# EAGLE design LEDMatrix (EAGLE 8.5.1)
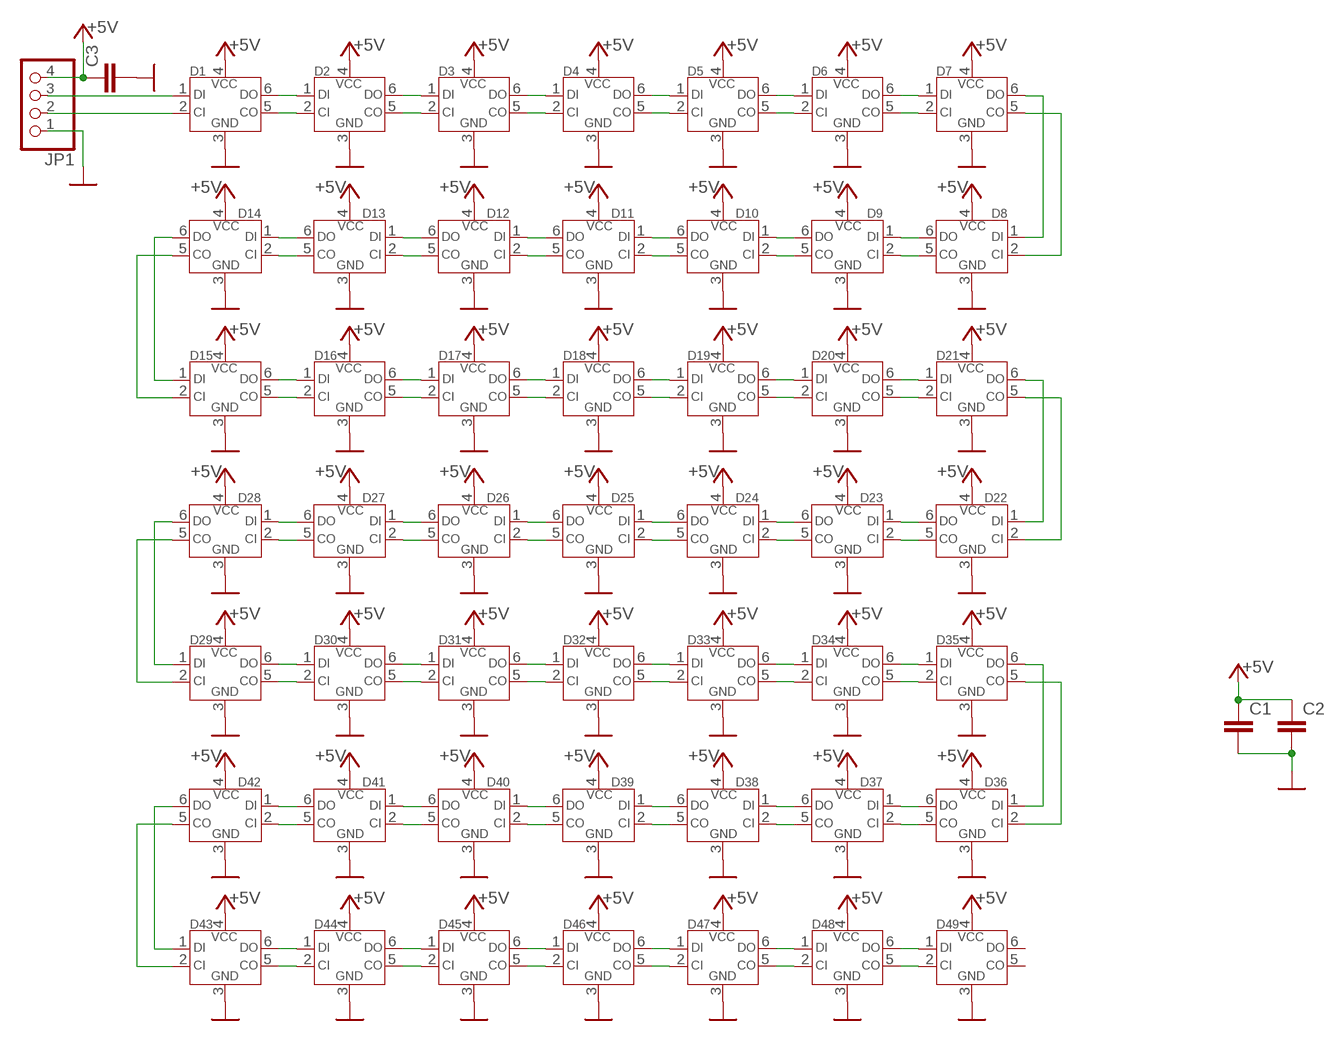
[diagram p0: schematic, sheet 1]

## Parts
C1  C-EUC0805  [C0805]
C2  C-EUC0805  [C0805]
C3  C-EUC0805  [C0805]
D1  QBLP679E-RGB  [LED_QBLP679E-RGB]
D2  QBLP679E-RGB  [LED_QBLP679E-RGB]
D3  QBLP679E-RGB  [LED_QBLP679E-RGB]
D4  QBLP679E-RGB  [LED_QBLP679E-RGB]
D5  QBLP679E-RGB  [LED_QBLP679E-RGB]
D6  QBLP679E-RGB  [LED_QBLP679E-RGB]
D7  QBLP679E-RGB  [LED_QBLP679E-RGB]
D8  QBLP679E-RGB  [LED_QBLP679E-RGB]
D9  QBLP679E-RGB  [LED_QBLP679E-RGB]
D10  QBLP679E-RGB  [LED_QBLP679E-RGB]
D11  QBLP679E-RGB  [LED_QBLP679E-RGB]
D12  QBLP679E-RGB  [LED_QBLP679E-RGB]
D13  QBLP679E-RGB  [LED_QBLP679E-RGB]
D14  QBLP679E-RGB  [LED_QBLP679E-RGB]
D15  QBLP679E-RGB  [LED_QBLP679E-RGB]
D16  QBLP679E-RGB  [LED_QBLP679E-RGB]
D17  QBLP679E-RGB  [LED_QBLP679E-RGB]
D18  QBLP679E-RGB  [LED_QBLP679E-RGB]
D19  QBLP679E-RGB  [LED_QBLP679E-RGB]
D20  QBLP679E-RGB  [LED_QBLP679E-RGB]
D21  QBLP679E-RGB  [LED_QBLP679E-RGB]
D22  QBLP679E-RGB  [LED_QBLP679E-RGB]
D23  QBLP679E-RGB  [LED_QBLP679E-RGB]
D24  QBLP679E-RGB  [LED_QBLP679E-RGB]
D25  QBLP679E-RGB  [LED_QBLP679E-RGB]
D26  QBLP679E-RGB  [LED_QBLP679E-RGB]
D27  QBLP679E-RGB  [LED_QBLP679E-RGB]
D28  QBLP679E-RGB  [LED_QBLP679E-RGB]
D29  QBLP679E-RGB  [LED_QBLP679E-RGB]
D30  QBLP679E-RGB  [LED_QBLP679E-RGB]
D31  QBLP679E-RGB  [LED_QBLP679E-RGB]
D32  QBLP679E-RGB  [LED_QBLP679E-RGB]
D33  QBLP679E-RGB  [LED_QBLP679E-RGB]
D34  QBLP679E-RGB  [LED_QBLP679E-RGB]
D35  QBLP679E-RGB  [LED_QBLP679E-RGB]
D36  QBLP679E-RGB  [LED_QBLP679E-RGB]
D37  QBLP679E-RGB  [LED_QBLP679E-RGB]
D38  QBLP679E-RGB  [LED_QBLP679E-RGB]
D39  QBLP679E-RGB  [LED_QBLP679E-RGB]
D40  QBLP679E-RGB  [LED_QBLP679E-RGB]
D41  QBLP679E-RGB  [LED_QBLP679E-RGB]
D42  QBLP679E-RGB  [LED_QBLP679E-RGB]
D43  QBLP679E-RGB  [LED_QBLP679E-RGB]
D44  QBLP679E-RGB  [LED_QBLP679E-RGB]
D45  QBLP679E-RGB  [LED_QBLP679E-RGB]
D46  QBLP679E-RGB  [LED_QBLP679E-RGB]
D47  QBLP679E-RGB  [LED_QBLP679E-RGB]
D48  QBLP679E-RGB  [LED_QBLP679E-RGB]
D49  QBLP679E-RGB  [LED_QBLP679E-RGB]
JP1  PINHD-1X4  [1X04]

## Nets
+5V: C1.1 C2.1 C3.1 D1.4(VCC) D2.4(VCC) D3.4(VCC) D4.4(VCC) D5.4(VCC) D6.4(VCC) D7.4(VCC) D8.4(VCC) D9.4(VCC) D10.4(VCC) D11.4(VCC) D12.4(VCC) D13.4(VCC) D14.4(VCC) D15.4(VCC) D16.4(VCC) D17.4(VCC) D18.4(VCC) D19.4(VCC) D20.4(VCC) D21.4(VCC) D22.4(VCC) D23.4(VCC) D24.4(VCC) D25.4(VCC) D26.4(VCC) D27.4(VCC) D28.4(VCC) D29.4(VCC) D30.4(VCC) D31.4(VCC) D32.4(VCC) D33.4(VCC) D34.4(VCC) D35.4(VCC) D36.4(VCC) D37.4(VCC) D38.4(VCC) D39.4(VCC) D40.4(VCC) D41.4(VCC) D42.4(VCC) D43.4(VCC) D44.4(VCC) D45.4(VCC) D46.4(VCC) D47.4(VCC) D48.4(VCC) D49.4(VCC) JP1.4
GND: C1.2 C2.2 C3.2 D1.3(GND) D2.3(GND) D3.3(GND) D4.3(GND) D5.3(GND) D6.3(GND) D7.3(GND) D8.3(GND) D9.3(GND) D10.3(GND) D11.3(GND) D12.3(GND) D13.3(GND) D14.3(GND) D15.3(GND) D16.3(GND) D17.3(GND) D18.3(GND) D19.3(GND) D20.3(GND) D21.3(GND) D22.3(GND) D23.3(GND) D24.3(GND) D25.3(GND) D26.3(GND) D27.3(GND) D28.3(GND) D29.3(GND) D30.3(GND) D31.3(GND) D32.3(GND) D33.3(GND) D34.3(GND) D35.3(GND) D36.3(GND) D37.3(GND) D38.3(GND) D39.3(GND) D40.3(GND) D41.3(GND) D42.3(GND) D43.3(GND) D44.3(GND) D45.3(GND) D46.3(GND) D47.3(GND) D48.3(GND) D49.3(GND) JP1.1
N$1: D1.6(DO) D2.1(DI)
N$2: D1.5(CO) D2.2(CI)
N$3: D2.6(DO) D3.1(DI)
N$4: D2.5(CO) D3.2(CI)
N$5: D3.6(DO) D4.1(DI)
N$6: D3.5(CO) D4.2(CI)
N$7: D4.6(DO) D5.1(DI)
N$8: D4.5(CO) D5.2(CI)
N$9: D5.6(DO) D6.1(DI)
N$10: D5.5(CO) D6.2(CI)
N$11: D6.6(DO) D7.1(DI)
N$12: D6.5(CO) D7.2(CI)
N$13: D8.6(DO) D9.1(DI)
N$14: D8.5(CO) D9.2(CI)
N$15: D9.6(DO) D10.1(DI)
N$16: D9.5(CO) D10.2(CI)
N$17: D10.6(DO) D11.1(DI)
N$18: D10.5(CO) D11.2(CI)
N$19: D11.6(DO) D12.1(DI)
N$20: D11.5(CO) D12.2(CI)
N$21: D12.6(DO) D13.1(DI)
N$22: D12.5(CO) D13.2(CI)
N$23: D13.6(DO) D14.1(DI)
N$24: D13.5(CO) D14.2(CI)
N$25: D7.6(DO) D8.1(DI)
N$26: D7.5(CO) D8.2(CI)
N$27: D15.6(DO) D16.1(DI)
N$28: D15.5(CO) D16.2(CI)
N$29: D16.6(DO) D17.1(DI)
N$30: D16.5(CO) D17.2(CI)
N$31: D17.6(DO) D18.1(DI)
N$32: D17.5(CO) D18.2(CI)
N$33: D18.6(DO) D19.1(DI)
N$34: D18.5(CO) D19.2(CI)
N$35: D19.6(DO) D20.1(DI)
N$36: D19.5(CO) D20.2(CI)
N$37: D20.6(DO) D21.1(DI)
N$38: D20.5(CO) D21.2(CI)
N$39: D22.6(DO) D23.1(DI)
N$40: D22.5(CO) D23.2(CI)
N$41: D23.6(DO) D24.1(DI)
N$42: D23.5(CO) D24.2(CI)
N$43: D24.6(DO) D25.1(DI)
N$44: D24.5(CO) D25.2(CI)
N$45: D25.6(DO) D26.1(DI)
N$46: D25.5(CO) D26.2(CI)
N$47: D26.6(DO) D27.1(DI)
N$48: D26.5(CO) D27.2(CI)
N$49: D27.6(DO) D28.1(DI)
N$50: D27.5(CO) D28.2(CI)
N$51: D21.6(DO) D22.1(DI)
N$52: D21.5(CO) D22.2(CI)
N$53: D29.6(DO) D30.1(DI)
N$54: D29.5(CO) D30.2(CI)
N$55: D30.6(DO) D31.1(DI)
N$56: D30.5(CO) D31.2(CI)
N$57: D31.6(DO) D32.1(DI)
N$58: D31.5(CO) D32.2(CI)
N$59: D32.6(DO) D33.1(DI)
N$60: D32.5(CO) D33.2(CI)
N$61: D33.6(DO) D34.1(DI)
N$62: D33.5(CO) D34.2(CI)
N$63: D34.6(DO) D35.1(DI)
N$64: D34.5(CO) D35.2(CI)
N$65: D36.6(DO) D37.1(DI)
N$66: D36.5(CO) D37.2(CI)
N$67: D37.6(DO) D38.1(DI)
N$68: D37.5(CO) D38.2(CI)
N$69: D38.6(DO) D39.1(DI)
N$70: D38.5(CO) D39.2(CI)
N$71: D39.6(DO) D40.1(DI)
N$72: D39.5(CO) D40.2(CI)
N$73: D40.6(DO) D41.1(DI)
N$74: D40.5(CO) D41.2(CI)
N$75: D41.6(DO) D42.1(DI)
N$76: D41.5(CO) D42.2(CI)
N$77: D35.6(DO) D36.1(DI)
N$78: D35.5(CO) D36.2(CI)
N$79: D14.6(DO) D15.1(DI)
N$80: D14.5(CO) D15.2(CI)
N$81: D28.6(DO) D29.1(DI)
N$82: D28.5(CO) D29.2(CI)
N$83: D43.6(DO) D44.1(DI)
N$84: D43.5(CO) D44.2(CI)
N$85: D44.6(DO) D45.1(DI)
N$86: D44.5(CO) D45.2(CI)
N$87: D45.6(DO) D46.1(DI)
N$88: D45.5(CO) D46.2(CI)
N$89: D46.6(DO) D47.1(DI)
N$90: D46.5(CO) D47.2(CI)
N$91: D47.6(DO) D48.1(DI)
N$92: D47.5(CO) D48.2(CI)
N$93: D48.6(DO) D49.1(DI)
N$94: D48.5(CO) D49.2(CI)
N$95: D1.1(DI) JP1.3
N$96: D1.2(CI) JP1.2
N$97: D42.6(DO) D43.1(DI)
N$98: D42.5(CO) D43.2(CI)
Unconnected: D49.5(CO) D49.6(DO)

## Library data of the parts
C1-C3 = rcl:C-EU: CAPACITOR, European symbol; SPICEPREFIX: C
D1-D49 = APA102-5050:QBLP679E-RGB: LED RGB DIFFUSED 6SMD; AVAILABILITY: Unavailable; DESCRIPTION: Led Rgb Diffused 6smd; MF: QT Brightek; MP: QBLP679E-RGB; PACKAGE: PLCC-6 QT Brightek; PRICE: None
JP1 = pinhead:PINHD-1X4: PIN HEADER

## Board
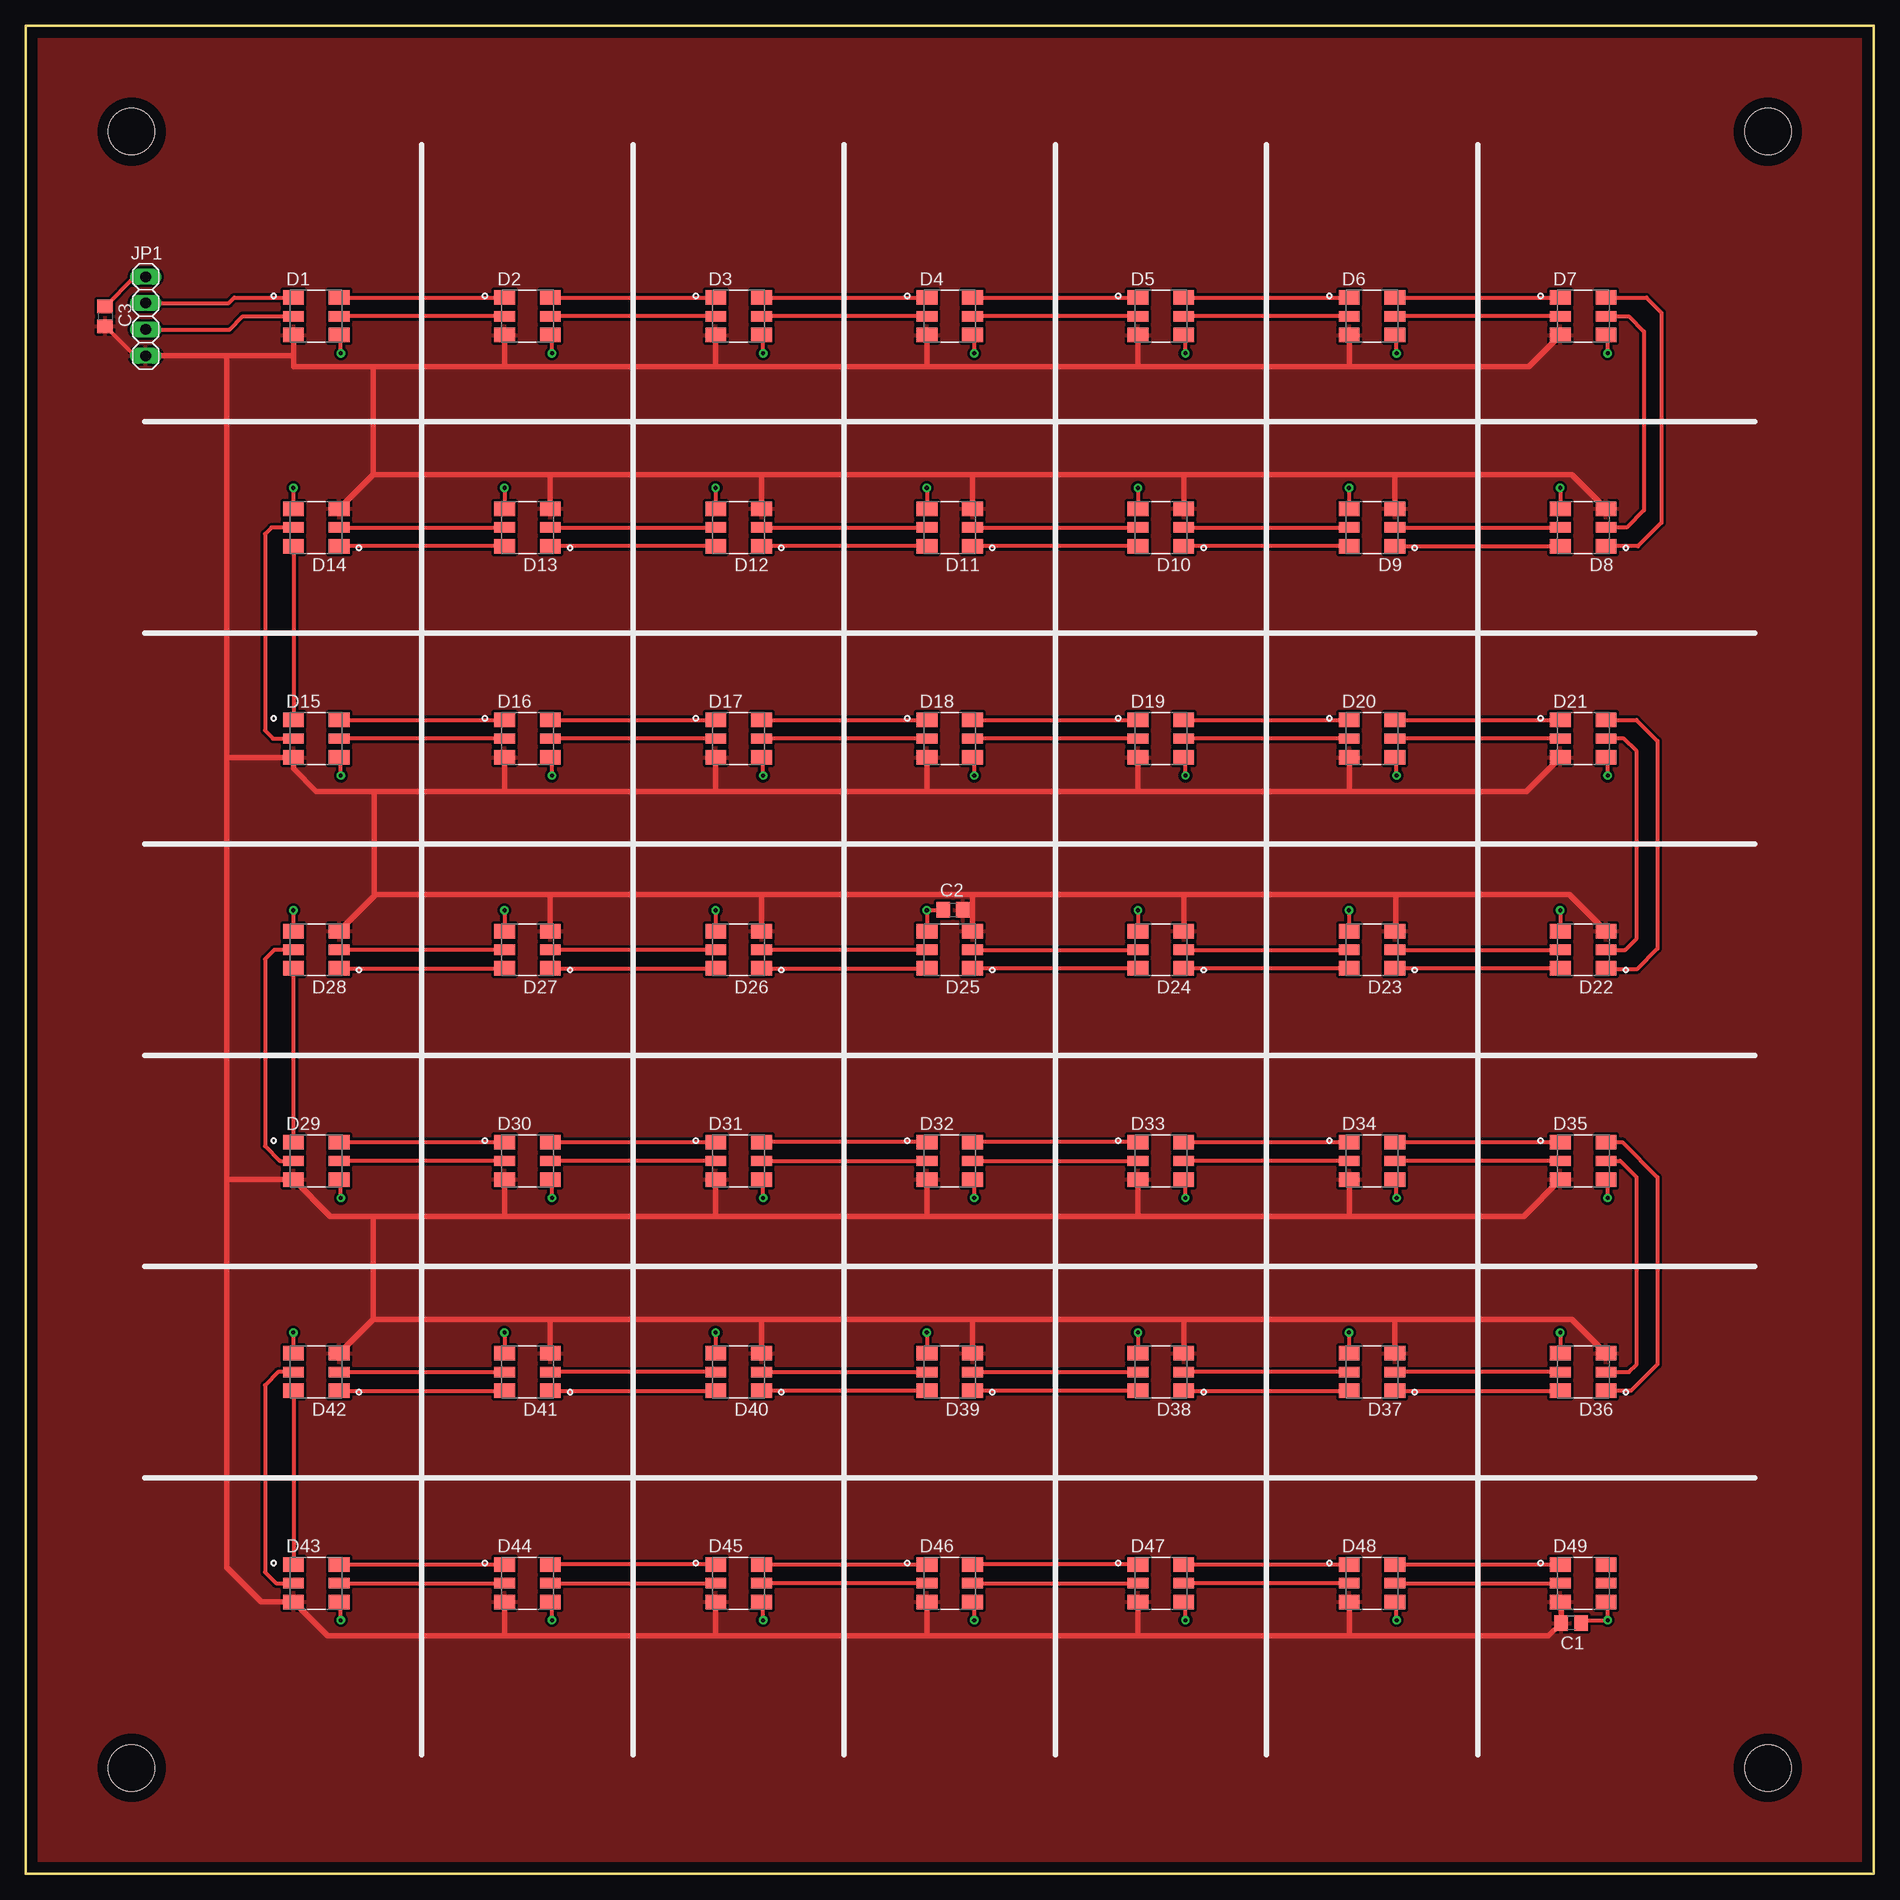
[diagram p1: board, top side]
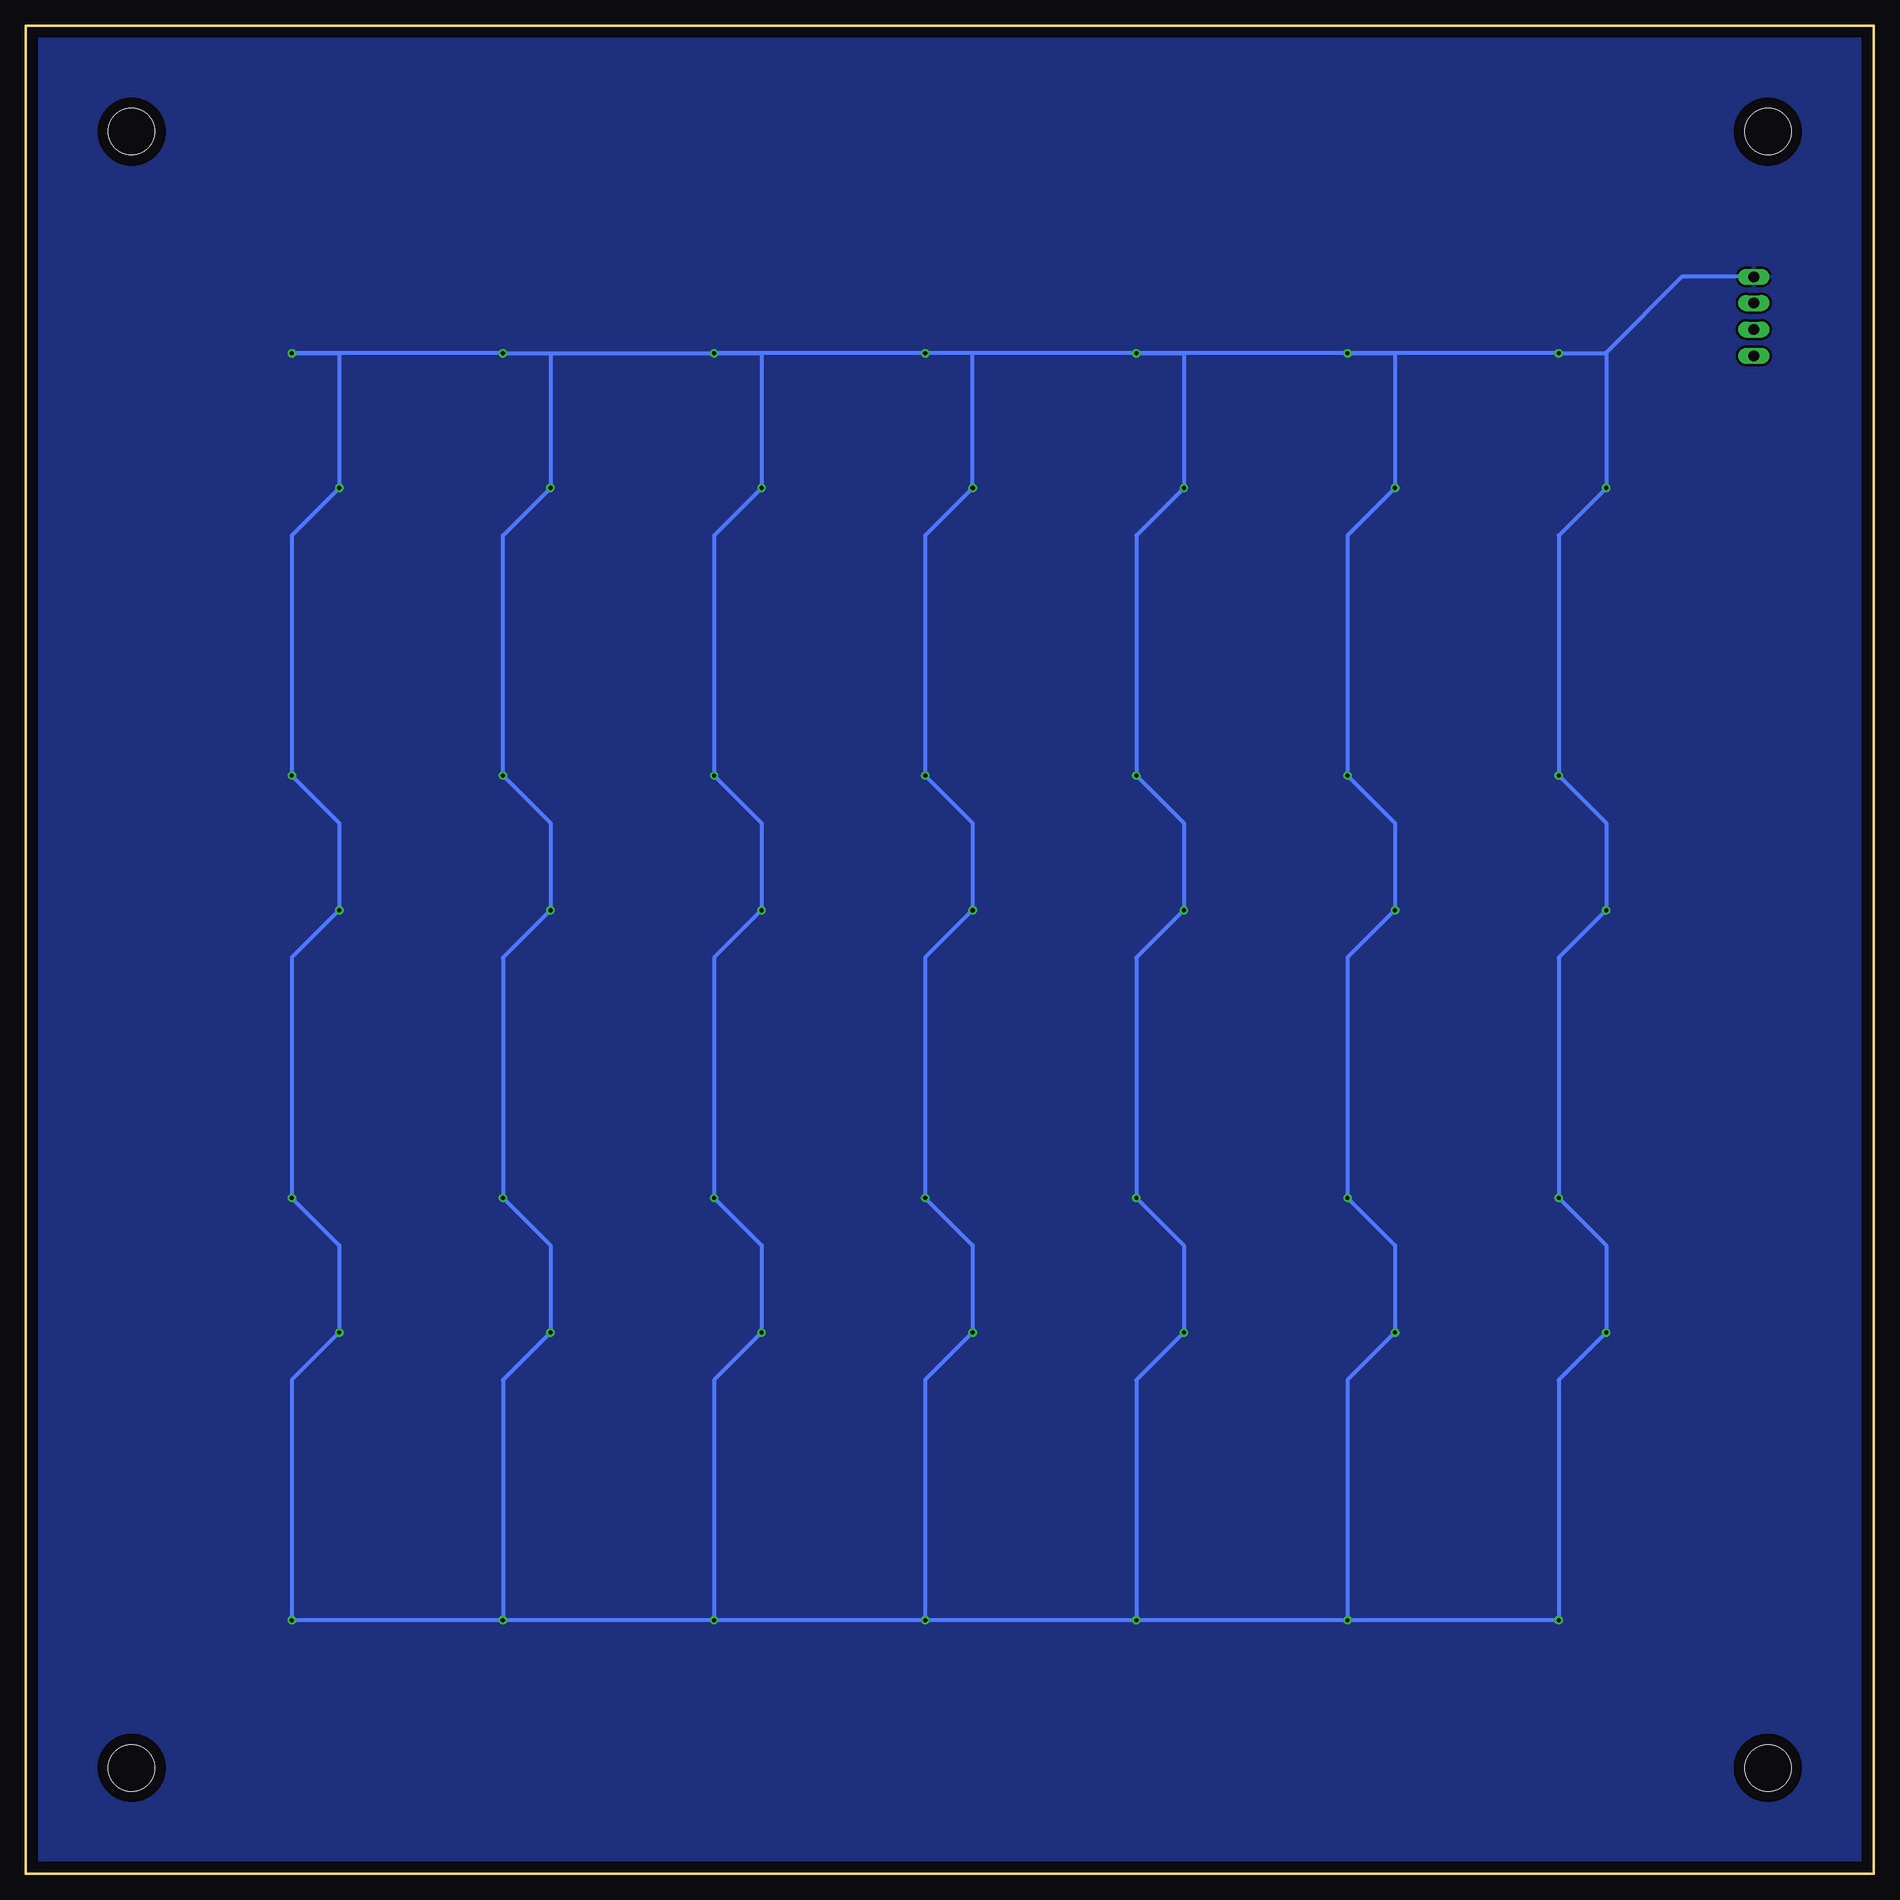
[diagram p2: board, bottom side, seen from below]

Size 177.8 x 177.8 mm. Coordinates in mm from the lower left corner, seen from the top.
Outline: 0,0 0,177.8 177.8,177.8 177.8,0 0,0
Copper layers (1*16): Top 0.035mm / dielectric 1.5mm / Bottom 0.035mm
Design rules "default": minimum track width 6mil, minimum drill 0.35mm, track to track 6mil, track to pad 6mil, pad to pad 6mil, via to via 6mil, smd to smd 6mil, copper to edge 40mil, drill to drill 6mil, minimum pad ring 10mil, minimum via ring 8mil, stop-mask expansion 4mil, vias tented up to drill 0mil, thermal gap 10mil
Holes 4.5 mm at 10.16,167.64 167.64,167.64 10.16,10.16 167.64,10.16

### Footprints (pad centres in the part's own frame; a part is rotated, then mirrored left to right if it is on the bottom)
C0805 = smd 1.3 x 1.5: 1 -0.95,0; 2 0.95,0
LED_QBLP679E-RGB = smd 2 x 1.4: 1 -2.2,1.8; 3 -2.2,-1.8; 4 2.2,-1.8; 6 2.2,1.8 | smd 2 x 1: 2 -2.2,0; 5 2.2,0
1X04 = drill 1.016 long: 1 -3.81,0; 2 -1.27,0; 3 1.27,0; 4 3.81,0

### Placement (x,y rotation side)
C1  148.7,24.1 180 top
C2  89.21,92.74 0 top
C3  7.62,149.86 270 top
D1  27.94,149.86 0 top
D2  48.26,149.86 0 top
D3  68.58,149.86 0 top
D4  88.9,149.86 0 top
D5  109.22,149.86 0 top
D6  129.54,149.86 0 top
D7  149.86,149.86 0 top
D8  149.86,129.54 180 top
D9  129.54,129.54 180 top
D10  109.22,129.54 180 top
D11  88.9,129.54 180 top
D12  68.58,129.54 180 top
D13  48.26,129.54 180 top
D14  27.94,129.54 180 top
D15  27.94,109.22 0 top
D16  48.26,109.22 0 top
D17  68.58,109.22 0 top
D18  88.9,109.22 0 top
D19  109.22,109.22 0 top
D20  129.54,109.22 0 top
D21  149.86,109.22 0 top
D22  149.86,88.9 180 top
D23  129.54,88.9 180 top
D24  109.22,88.9 180 top
D25  88.9,88.9 180 top
D26  68.58,88.9 180 top
D27  48.26,88.9 180 top
D28  27.94,88.9 180 top
D29  27.94,68.58 0 top
D30  48.26,68.58 0 top
D31  68.58,68.58 0 top
D32  88.9,68.58 0 top
D33  109.22,68.58 0 top
D34  129.54,68.58 0 top
D35  149.86,68.58 0 top
D36  149.86,48.26 180 top
D37  129.54,48.26 180 top
D38  109.22,48.26 180 top
D39  88.9,48.26 180 top
D40  68.58,48.26 180 top
D41  48.26,48.26 180 top
D42  27.94,48.26 180 top
D43  27.94,27.94 0 top
D44  48.26,27.94 0 top
D45  68.58,27.94 0 top
D46  88.9,27.94 0 top
D47  109.22,27.94 0 top
D48  129.54,27.94 0 top
D49  149.86,27.94 0 top
JP1  11.52,149.86 90 top

### Tracks (layer width: path | path; a pad name or v marks a point on that pad's centre or on a via)
+5V  (via drill 0.4)
  Top 0.406: v30.3,146.3 30.3,147.9 D1.4 | v50.62,146.3 50.62,147.9 D2.4 | v70.94,146.3 70.94,147.9 D3.4 | v91.26,146.3 91.26,147.9 D4.4 | v111.58,146.3 111.58,147.9 D5.4 | v131.9,146.3 131.9,147.9 D6.4 | v152.22,146.3 152.22,147.9 D7.4 | D14.4 25.73,131.35 v25.73,133.35 25.78,133.4 | D13.4 46.05,131.35 v46.05,133.35 46.1,133.4 | D12.4 66.37,131.35 v66.37,133.35 66.42,133.4 | D11.4 86.69,131.35 v86.69,133.35 86.74,133.4 | D10.4 107.01,131.35 v107.01,133.35 107.06,133.4 | D9.4 127.33,131.35 v127.33,133.35 127.38,133.4 | D8.4 147.65,131.35 v147.65,133.35 147.7,133.4 | v152.22,105.66 152.22,107.26 D21.4 | v131.9,105.66 131.9,107.26 D20.4 | v111.58,105.66 111.58,107.26 D19.4 | v91.26,105.66 91.26,107.26 D18.4 | v70.94,105.66 70.94,107.26 D17.4 | v50.62,105.66 50.62,107.26 D16.4 | v30.3,105.66 30.3,107.26 D15.4 | D28.4 25.73,90.71 v25.73,92.71 v25.73,92.7 | D27.4 46.05,90.71 v46.05,92.71 v46.05,92.7 | D26.4 66.37,90.71 v66.37,92.71 v66.37,92.7 | D25.4 86.69,90.71 v86.69,92.71 v86.69,92.7 88.22,92.7 C2.1 | D24.4 107.01,90.71 v107.01,92.71 v107.01,92.7 | D23.4 127.33,90.71 v127.33,92.71 v127.33,92.7 | D22.4 147.65,90.71 v147.65,92.71 v147.65,92.7 | v152.22,65.02 152.22,66.62 D35.4 | v131.9,65.02 131.9,66.62 D34.4 | v111.58,65.02 111.58,66.62 D33.4 | v91.26,65.02 91.26,66.62 D32.4 | v70.94,65.02 70.94,66.62 D31.4 | v50.62,65.02 50.62,66.62 D30.4 | v30.3,65.02 30.3,66.62 D29.4 | D42.4 25.73,50.07 v25.73,52.07 25.76,52.1 | D41.4 46.05,50.07 v46.05,52.07 46.08,52.1 | D40.4 66.37,50.07 v66.37,52.07 66.4,52.1 | D39.4 86.69,50.07 v86.69,52.07 86.72,52.1 | D38.4 107.01,50.07 v107.01,52.07 107.04,52.1 | D37.4 127.33,50.07 v127.33,52.07 127.36,52.1
  Top 0.406: D36.4 147.65,50.07 v147.65,52.07 147.68,52.1 | D49.4 152.22,25.98 v152.22,24.38 149.93,24.38 C1.1 | v131.9,24.38 131.9,25.98 D48.4 | v111.58,24.38 111.58,25.98 D47.4 | v91.26,24.38 91.26,25.98 D46.4 | v70.94,24.38 70.94,25.98 D45.4 | v50.62,24.38 50.62,25.98 D44.4 | v30.3,24.38 30.3,25.98 D43.4 | C3.1 10.48,153.67 JP1.4
  Bottom 0.406: 25.73,146.3 v30.3,146.3 v50.62,146.3 | 25.73,146.3 v25.73,133.35 30.3,128.77 v30.3,105.66 25.73,101.09 v25.73,92.71 30.3,88.13 v30.3,65.02 25.73,60.45 v25.73,52.07 30.3,47.49 v30.3,24.38 v50.62,24.38 | v50.62,146.3 46.05,146.3 v46.05,133.35 50.62,128.77 v50.62,105.66 46.05,101.09 v46.05,92.71 50.62,88.13 v50.62,65.02 46.05,60.45 v46.05,52.07 50.62,47.49 v50.62,24.38 | v70.94,146.3 66.37,146.3 v66.37,133.35 70.94,128.77 v70.94,105.66 66.37,101.09 v66.37,92.71 70.94,88.13 v70.94,65.02 66.37,60.45 v66.37,52.07 70.94,47.49 v70.94,24.38 | v91.26,146.3 86.76,146.3 86.69,146.23 v86.69,133.35 91.26,128.77 v91.26,105.66 86.69,101.09 v86.69,92.71 91.26,88.13 v91.26,65.02 86.69,60.45 v86.69,52.07 91.26,47.49 v91.26,24.38 | v111.58,146.3 107.01,146.3 v107.01,133.35 111.58,128.77 v111.58,105.66 107.01,101.09 v107.01,92.71 111.58,88.13 v111.58,65.02 107.01,60.45 v107.01,52.07 111.58,47.49 v111.58,24.38 | v131.9,146.3 127.33,146.3 v127.33,133.35 131.9,128.77 v131.9,105.66 127.33,101.09 v127.33,92.71 131.9,88.13 v131.9,65.02 127.33,60.45 v127.33,52.07 131.9,47.49 v131.9,24.38 | v50.62,24.38 v70.94,24.38 | v70.94,24.38 v91.26,24.38 | v91.26,24.38 v111.58,24.38 | v111.58,24.38 v131.9,24.38 | v131.9,24.38 v152.22,24.38 152.22,47.49 v147.65,52.07 147.65,60.45 v152.22,65.02 152.22,88.13 v147.65,92.71 147.65,101.09 v152.22,105.66 152.22,128.77 v147.65,133.35 147.65,146.3 v152.22,146.3 v131.9,146.3 | v50.62,146.3 v70.94,146.3 | v70.94,146.3 v91.26,146.3 | v91.26,146.3 v111.58,146.3 | v131.9,146.3 v111.58,146.3 | JP1.4 18.43,153.67 25.73,146.37 25.73,146.3
  pour Bottom (isolate 0.254, rank 6): 0,177.8 0,0 177.8,0 177.8,177.8
GND
  Top 0.406: C3.2 10.48,146.05 JP1.1
  Top 0.508: 33.53,104.14 27.94,104.14 25.74,106.34 D15.3 19.33,107.42 | 66.29,104.14 86.61,104.14 | 86.61,104.14 106.93,104.14 | 106.93,104.14 127.25,104.14 | 127.25,104.14 144.38,104.14 D21.3 | D20.3 127.34,104.23 127.25,104.14 | D19.3 107.02,104.23 106.93,104.14 | D18.3 86.7,104.23 86.61,104.14 | D17.3 66.38,104.23 66.29,104.14 | D14.3 33.42,134.62 | D8.3 148.78,134.62 131.83,134.62 | 50.55,134.62 33.42,134.62 | 50.55,134.62 70.87,134.62 | 70.87,134.62 91.19,134.62 | 91.19,134.62 111.51,134.62 | 111.51,134.62 131.83,134.62 | D9.3 131.74,134.53 131.83,134.62 | D10.3 111.42,134.53 111.51,134.62 | D11.3 91.1,134.53 91.19,134.62 | D12.3 70.78,134.53 70.87,134.62 | D13.3 50.46,134.53 50.55,134.62 | D7.3 144.63,145.03 127.25,145.03 | 45.97,145.03 66.29,145.03 | 66.29,145.03 86.61,145.03 | 86.61,145.03 106.93,145.03 | 106.93,145.03 127.25,145.03 | D6.3 127.34,145.12 127.25,145.03 | D5.3 107.02,145.12 106.93,145.03 | D4.3 86.7,145.12 86.61,145.03 | D3.3 66.38,145.12 66.29,145.03 | D2.3 46.06,145.12 45.97,145.03 | D28.3 33.67,94.23 | D22.3 148.53,94.23 131.83,94.23 | 50.29,94.23 33.67,94.23 | 50.29,94.23 70.87,94.23 | 70.87,94.23 91.19,94.23 | 91.19,94.23 111.51,94.23 | 111.51,94.23 131.83,94.23 | D23.3 131.83,90.79 131.83,94.23 | D24.3 111.42,94.15 111.51,94.23 | D25.3 91.1,92.71 | 91.1,92.71 91.1,94.15 91.19,94.23 | D26.3 70.78,94.15 70.87,94.23 | D27.3 50.46,94.07 50.29,94.23 | 33.67,94.23 33.53,94.38 33.53,104.14 | 19.33,145.86 19.33,107.42 | 19.33,107.42 19.33,66.8 | 19.33,66.8 19.33,29.44 22.63,26.14 D43.3 29.02,22.86 45.97,22.86 | 19.33,66.8 19.35,66.78 D29.3 29.27,63.25 33.27,63.25 | D35.3 144.13,63.25 127.25,63.25 | 33.27,63.25 46.23,63.25
  Top 0.508: 46.23,63.25 66.29,63.25 | 66.29,63.25 86.61,63.25 | 86.61,63.25 107.19,63.25 | 107.19,63.25 127.25,63.25 | D34.3 127.34,63.33 127.25,63.25 | D33.3 107.02,63.41 107.19,63.25 | D32.3 86.7,63.33 86.61,63.25 | D31.3 66.38,63.33 66.29,63.25 | D30.3 46.06,63.41 46.23,63.25 | D42.3 33.42,53.34 | D36.3 148.78,53.34 131.83,53.34 | 33.42,53.34 50.29,53.34 | 50.29,53.34 70.61,53.34 | 70.61,53.34 90.93,53.34 | 90.93,53.34 111.51,53.34 | 111.51,53.34 131.83,53.34 | D37.3 131.74,53.25 131.83,53.34 | D38.3 111.42,53.25 111.51,53.34 | D39.3 91.1,53.17 90.93,53.34 | D40.3 70.78,53.17 70.61,53.34 | D41.3 50.46,53.17 50.29,53.34 | 33.42,53.34 33.42,63.1 33.27,63.25 | 45.97,22.86 66.29,22.86 | 66.29,22.86 86.61,22.86 | 86.61,22.86 107.19,22.86 | 107.19,22.86 127.51,22.86 | D48.3 127.34,23.03 127.51,22.86 | D47.3 107.02,23.03 107.19,22.86 | D46.3 86.7,22.95 86.61,22.86 | D45.3 66.38,22.95 66.29,22.86 | D44.3 46.06,22.95 45.97,22.86 | 33.53,104.14 46.06,104.14 | 46.06,104.14 66.29,104.14 | D16.3 46.06,104.14 | 127.51,22.86 146.51,22.86 C1.2 147.75,26.05 D49.3 | C2.2 91.07,92.74 91.1,92.71 | 25.74,146.05 D1.3 | 25.74,146.05 25.74,145.03 33.42,145.03 | 33.42,145.03 45.97,145.03 | 33.42,134.62 33.42,145.03 | JP1.1 25.74,146.05
  pour Top (isolate 0.254, rank 6): 0,177.8 177.8,177.8 177.8,0 0,0
N$1
  Top 0.406: D1.6 D2.1
N$2
  Top 0.406: D2.2 D1.5
N$3
  Top 0.406: D2.6 D3.1
N$4
  Top 0.406: D3.2 D2.5
N$5
  Top 0.406: D3.6 D4.1
N$6
  Top 0.406: D4.2 D3.5
N$7
  Top 0.406: D4.6 D5.1
N$8
  Top 0.406: D5.2 D4.5
N$9
  Top 0.406: D5.6 D6.1
N$10
  Top 0.406: D6.2 D5.5
N$11
  Top 0.406: D6.6 D7.1
N$12
  Top 0.406: D7.2 D6.5
N$13
  Top 0.406: D9.1 D8.6
N$14
  Top 0.406: D9.2 D8.5
N$15
  Top 0.406: D9.6 D10.1
N$16
  Top 0.406: D10.2 D9.5
N$17
  Top 0.406: D10.6 D11.1
N$18
  Top 0.406: D11.2 D10.5
N$19
  Top 0.406: D11.6 D12.1
N$20
  Top 0.406: D12.2 D11.5
N$21
  Top 0.406: D12.6 D13.1
N$22
  Top 0.406: D13.2 D12.5
N$23
  Top 0.406: D13.6 D14.1
N$24
  Top 0.406: D14.2 D13.5
N$25
  Top 0.406: D7.6 155.94,151.66 157.4,150.2 157.4,130 155.14,127.74 D8.1
N$26
  Top 0.406: D7.5 154.24,149.86 155.7,148.4 155.7,131.2 154.04,129.54 D8.2
N$27
  Top 0.406: D15.6 D16.1
N$28
  Top 0.406: D16.2 D15.5
N$29
  Top 0.406: D16.6 D17.1
N$30
  Top 0.406: D17.2 D16.5
N$31
  Top 0.406: D17.6 D18.1
N$32
  Top 0.406: D18.2 D17.5
N$33
  Top 0.406: D18.6 D19.1
N$34
  Top 0.406: D19.2 D18.5
N$35
  Top 0.406: D19.6 D20.1
N$36
  Top 0.406: D20.2 D19.5
N$37
  Top 0.406: D20.6 D21.1
N$38
  Top 0.406: D21.2 D20.5
N$39
  Top 0.406: D22.6 D23.1
N$40
  Top 0.406: D23.2 D22.5
N$41
  Top 0.406: D23.6 D24.1
N$42
  Top 0.406: D24.2 D23.5
N$43
  Top 0.406: D24.6 D25.1
N$44
  Top 0.406: D25.2 D24.5
N$45
  Top 0.406: D26.1 D25.6
N$46
  Top 0.406: D25.5 D26.2
N$47
  Top 0.406: D27.1 D26.6
N$48
  Top 0.406: D26.5 D27.2
N$49
  Top 0.406: D28.1 D27.6
N$50
  Top 0.406: D27.5 D28.2
N$51
  Top 0.406: D21.6 154.98,111.02 157,109 157,89 155,87 152.16,87 D22.1
N$52
  Top 0.406: D22.2 153.9,88.9 155,90 155,108 153.78,109.22 D21.5
N$53
  Top 0.406: D29.6 D30.1
N$54
  Top 0.406: D30.2 D29.5
N$55
  Top 0.406: D30.6 D31.1
N$56
  Top 0.406: D31.2 D30.5
N$57
  Top 0.406: D32.1 D31.6
N$58
  Top 0.406: D31.5 D32.2
N$59
  Top 0.406: D33.1 D32.6
N$60
  Top 0.406: D32.5 D33.2
N$61
  Top 0.406: D33.6 D34.1
N$62
  Top 0.406: D34.2 D33.5
N$63
  Top 0.406: D34.6 D35.1
N$64
  Top 0.406: D35.2 D34.5
N$65
  Top 0.406: D37.1 D36.6
N$66
  Top 0.406: D36.5 D37.2
N$67
  Top 0.406: D38.1 D37.6
N$68
  Top 0.406: D37.5 D38.2
N$69
  Top 0.406: D38.6 D39.1
N$70
  Top 0.406: D39.2 D38.5
N$71
  Top 0.406: D39.6 D40.1
N$72
  Top 0.406: D40.2 D39.5
N$73
  Top 0.406: D41.1 D40.6
N$74
  Top 0.406: D40.5 D41.2
N$75
  Top 0.406: D42.1 D41.6
N$76
  Top 0.406: D42.2 D41.5
N$77
  Top 0.406: D35.6 153.62,70.38 157,67 157,49 154.46,46.46 D36.1
N$78
  Top 0.406: D35.5 153.42,68.58 155,67 155,49 154.26,48.26 D36.2
N$79
  Top 0.406: D14.6 D15.1
N$80
  Top 0.406: D14.5 23.64,129.54 23,128.9 23,110 23.78,109.22 D15.2
N$81
  Top 0.406: D29.1 D28.6
N$82
  Top 0.406: D28.5 23.9,88.9 23,88 23,70 24.42,68.58 D29.2
N$83
  Top 0.406: D43.6 D44.1
N$84
  Top 0.406: D43.5 D44.2
N$85
  Top 0.406: D45.1 D44.6
N$86
  Top 0.406: D44.5 D45.2
N$87
  Top 0.406: D45.6 D46.1
N$88
  Top 0.406: D46.2 D45.5
N$89
  Top 0.406: D47.1 D46.6
N$90
  Top 0.406: D46.5 D47.2
N$91
  Top 0.406: D47.6 D48.1
N$92
  Top 0.406: D48.2 D47.5
N$93
  Top 0.406: D48.6 D49.1
N$94
  Top 0.406: D48.5 D49.2
N$95
  Top 0.406: D1.1 20.06,151.66 19.53,151.13 JP1.3
N$96
  Top 0.406: D1.2 20.86,149.86 19.59,148.59 JP1.2
N$97
  Top 0.406: D42.6 D43.1
N$98
  Top 0.406: D42.5 24.26,48.26 23,47 23,29 24.06,27.94 D43.2